# EAGLE design ESP8266-DS18B20-lite (EAGLE 7.6.0)
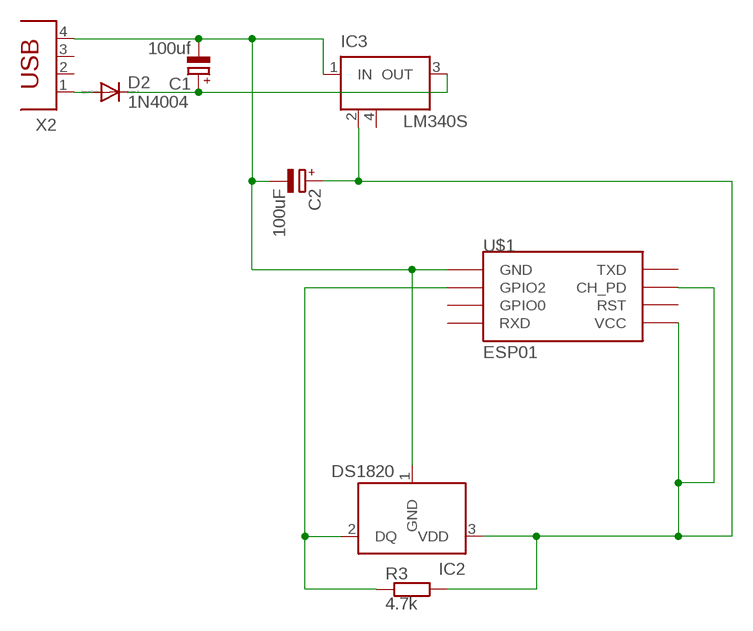
[diagram p0: schematic, sheet 1]

## Parts
C1  100uf  CPOL-EUE2.5-5  [E2,5-5]
C2  100uF  CPOL-EUE2.5-5  [E2,5-5]
D2  1N4004  [DO41-10]
IC2  DS1820  [TO-92]
IC3  LM340S  [SOT223]
R3  4.7k  SMK  [SMK]
U$1  ESP01  [ESP01]
X2  PN61729  [PN61729]

## Nets
3V3: C2.+ IC2.3(VDD) IC3.2(GND) R3.1 U$1.CH_PD U$1.VCC
5V: C1.+ D2.A D2.C IC3.3(OUT) X2.1
DQ: IC2.2(DQ) R3.2 U$1.GPIO2
GND: C1.- C2.- IC2.1(GND) IC3.1(IN) U$1.GND X2.4
Unconnected: U$1.GPIO0 U$1.RST U$1.RX(RXD) U$1.TX(TXD) X2.2 X2.3

## Power pins joined to a net without a drawn wire
GND: IC3.4(GND)

## Library data of the parts
C1 C2 = rcl:CPOL-EU: POLARIZED CAPACITOR, European symbol
D2 = diode:1N4004: DIODE general purpose rectifier, 1 A
IC2 = DS1820:DS1820: DS1820 - 1-Wire Digital Thermometer
IC3 = linear:LM340S: 3-Terminal Positive Regulators Source: http://cache.national.com/ds/LM/LM340.pdf
R3 = resistor-shunt:SMK: SMD SHUNT RESISTOR; OC_FARNELL: unknown; OC_NEWARK: unknown
U$1 = esp8266modules:ESP01: ESP8266 Wifi module 01
X2 = con-berg:PN61729: BERG USB connector; OC_FARNELL: unknown; OC_NEWARK: unknown

## Board
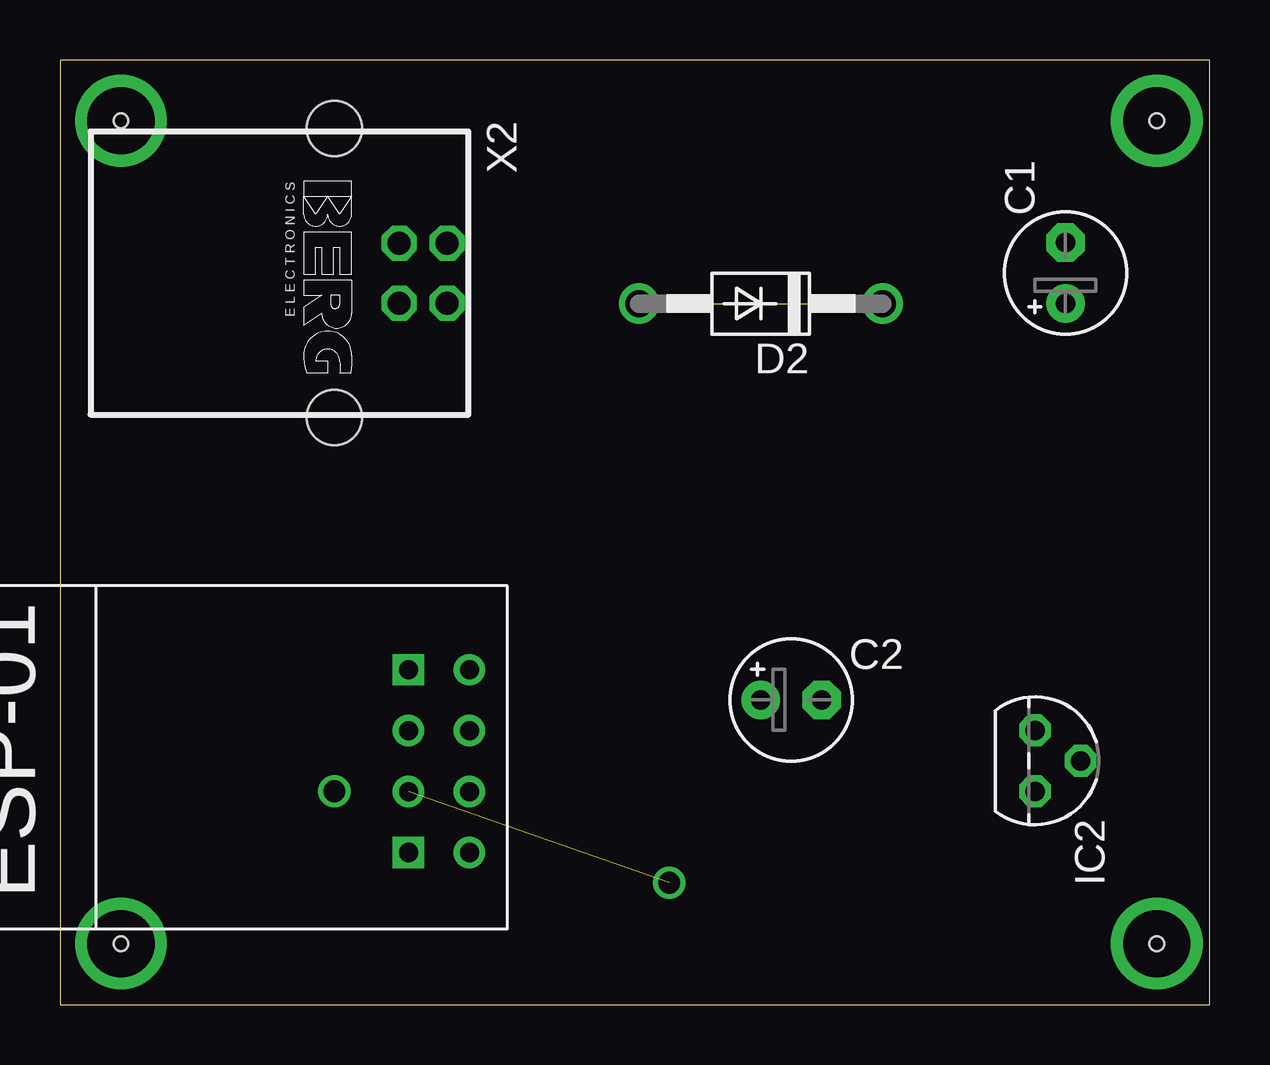
[diagram p1: board, top side]
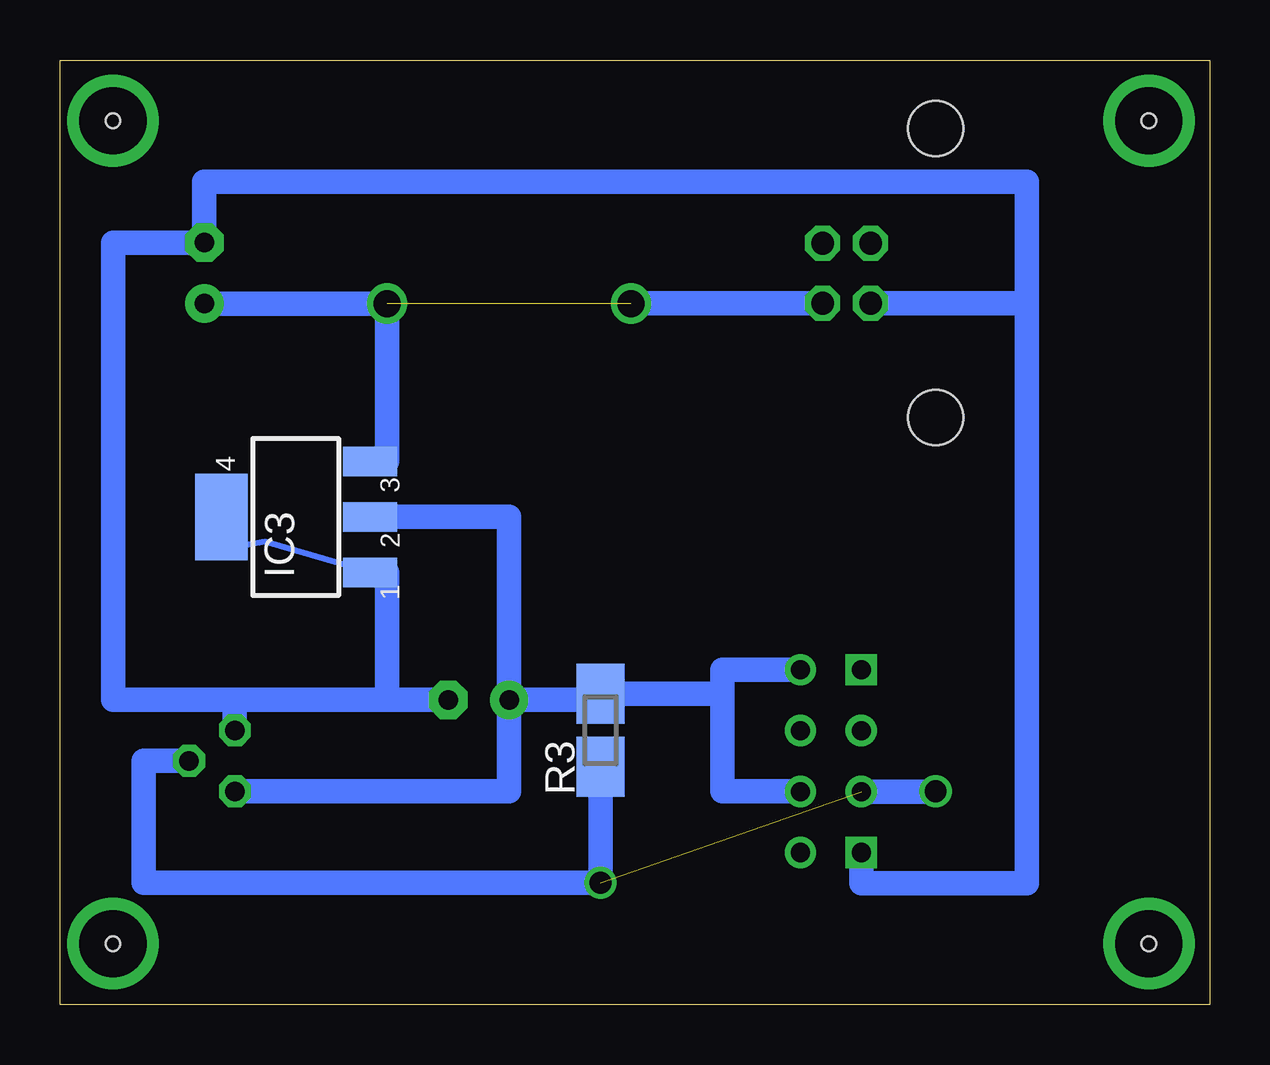
[diagram p2: board, bottom side, seen from below]

Size 47.93 x 39.36 mm. Coordinates in mm from the lower left corner, seen from the top.
Outline: 0,0 47.93,0 47.93,39.36 0,39.36 0,0
Copper layers (1*16): Top 0.035mm / dielectric 1.5mm / Bottom 0.035mm
Design rules "default": minimum track width 10mil, minimum drill 24mil, track to track 8mil, track to pad 8mil, pad to pad 8mil, via to via 8mil, smd to smd 8mil, copper to edge 40mil, drill to drill 8mil, minimum pad ring 10mil, minimum via ring 8mil, stop-mask expansion 4mil, vias tented up to drill 0mil, thermal gap 10mil
Holes 0.6 mm at 45.72,36.83 2.54,2.54 45.72,2.54 2.54,36.83

### Footprints (pad centres in the part's own frame; a part is rotated, then mirrored left to right if it is on the bottom)
E2,5-5 = drill 0.813 pad 1.6: + -1.27,0 | drill 0.813 pad 1.6 octagon: - 1.27,0
DO41-10 = drill 1.118: A 5.08,0; C -5.08,0
TO-92 = drill 0.813 pad 1.27 octagon: 1 -1.27,0; 2 0,1.905; 3 1.27,0
SOT223 = smd 1.219 x 2.235: 1 -2.311,-3.099; 2 0,-3.099; 3 2.311,-3.099 | smd 3.6 x 2.2: 4 0,3.099
SMK = smd 2.5 x 2: 1 1.524,0; 2 -1.524,0
ESP01 = drill 0.8: CH_PD -1.285,-8.178; GPIO0 1.255,-5.638; GPIO2 -1.285,-5.638; RST 1.255,-8.178; TX -3.825,-8.178; VCC 3.795,-8.178 | drill 0.8 square: GND -3.825,-5.638; RX 3.795,-5.638
PN61729 = drill 0.95 octagon: 1 1.25,4.71; 2 -1.25,4.71; 3 -1.25,2.71; 4 1.25,2.71 | hole 2.3: -6.02,0; 6.02,0

### Placement (x,y rotation side)
C1  41.91,30.48 90 top
C2  30.48,12.7 0 top
D2  29.21,29.21 180 top
IC2  40.64,10.16 270 top
IC3  38.1,20.32 90 bottom
R3  25.4,11.43 90 bottom
U$1  8.89,10.16 90 top
X2  11.43,30.48 270 top

### Tracks (layer width: path | path; a pad name or v marks a point on that pad's centre or on a via)
3V3
  Bottom 1.016: U$1.VCC 20.32,13.95 20.32,12.95 | 20.32,12.95 20.32,8.89 U$1.CH_PD | IC3.2 29.21,20.32 C2.+ | C2.+ 25.4,12.7 R3.1 20.32,12.95 | C2.+ 29.21,8.89 IC2.3
5V  (1 unrouted)
  Bottom 1.016: C1.+ D2.C 34.29,22.63 IC3.3 | X2.1 24.13,29.23 D2.A
DQ  (via drill 0.9)  (1 unrouted)
  Bottom 1.016: IC2.2 44.45,10.16 44.45,5.08 v25.4,5.08 R3.2 | U$1.GPIO2 11.43,8.88 11.43,8.89
GND
  Bottom 0.254: IC3.1 39.37,19.28 40.64,19.05 41.2,19.05 IC3.4
  Bottom 1.016: X2.4 7.62,29.23 | 7.62,29.23 7.62,5.06 14.53,5.06 U$1.GND | 7.62,29.23 7.62,34.29 41.91,34.29 C1.- 45.72,31.75 45.72,12.7 40.64,12.7 | C2.- 34.29,12.7 | 34.29,12.7 40.64,12.7 | IC3.1 34.29,18.01 34.29,12.7 | IC2.1 40.64,12.7
N$2  (via drill 0.9)
  other vias: 11.43,8.89
N$3  (via drill 2.8)
  other vias: 45.72,36.83
N$4  (via drill 2.8)
  other vias: 2.54,36.83
N$5  (via drill 2.8)
  other vias: 2.54,2.54
N$6  (via drill 2.8)
  other vias: 45.72,2.54